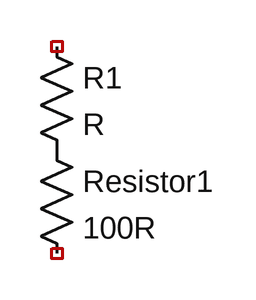
[diagram p0: schematic Resistor1.asc]
Resistor1.asc, the LTspice schematic file:
Version 4
SHEET 1 880 680
SYMBOL res 128 0 R0
SYMATTR InstName Resistor1
SYMATTR Value 100R
SYMATTR SpiceLine tol=25 pwr=1
SYMBOL res 128 -80 R0
SYMATTR InstName R1

The netlist it stands for:
* Resistor1.asc
Resistor1 P001 NC_01 100R tol=25 pwr=1
R1 NC_02 P001 R
.backanno
.end